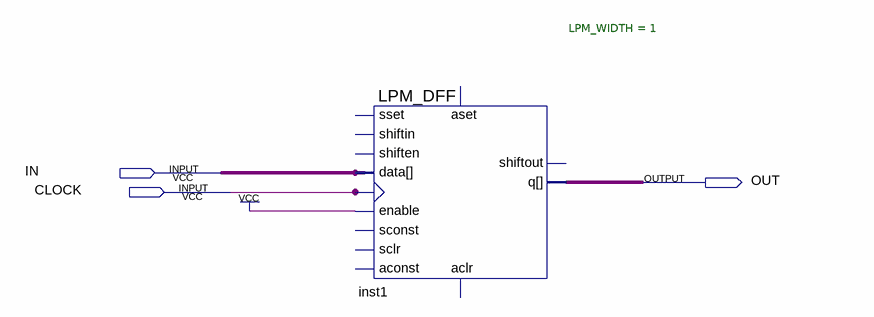
[diagram p0: schematic sheet]
// Quartus schematic PIPE1.bdf as structural Verilog: 1 symbols, 3 pins
module PIPE1 (
  input  IN,
  input  CLOCK,
  output OUT
);

  LPM_DFF #(.LPM_WIDTH(1)) inst1 (
    .enable(1'b1), .clock(CLOCK), .data(IN), .q(OUT));  // open: shiftin, shiften, aconst, sclr, sconst, sset, aset, aclr, shiftout
endmodule
